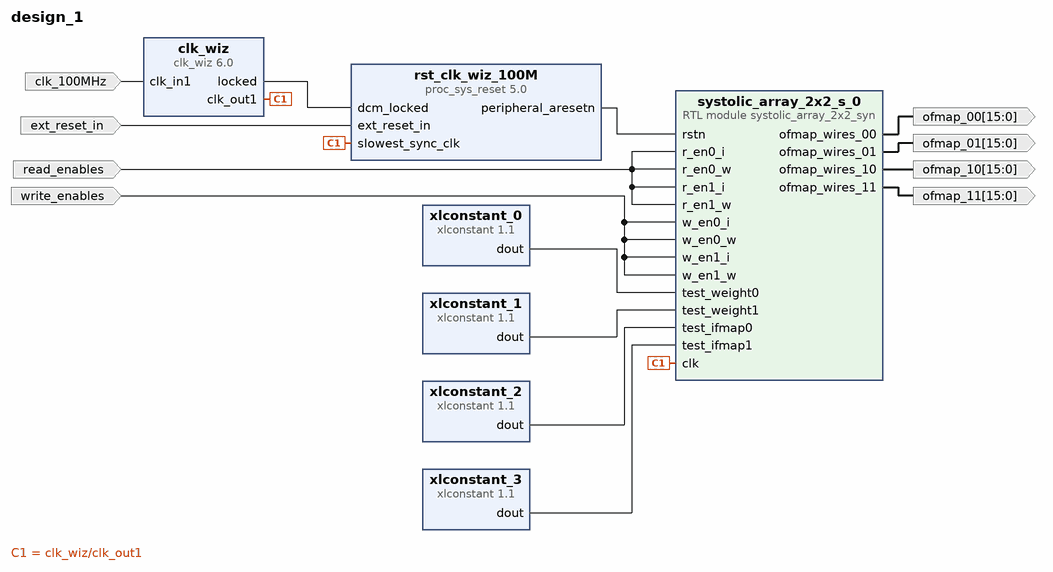
[diagram p0: block diagram of the top level]
# Vivado block design design_1, xczu7ev-ffvc1156-2-e, Vivado 2024.1
create_bd_design design_1

create_bd_port -dir I -type clk clk_100MHz
set_property -dict {CONFIG.FREQ_HZ 100000000} [get_bd_ports clk_100MHz]
create_bd_port -dir I read_enables
create_bd_port -dir I write_enables
create_bd_port -dir I ext_reset_in
create_bd_port -dir O -from 15 -to 0 ofmap_00
create_bd_port -dir O -from 15 -to 0 ofmap_01
create_bd_port -dir O -from 15 -to 0 ofmap_10
create_bd_port -dir O -from 15 -to 0 ofmap_11

create_bd_cell -type module -reference systolic_array_2x2_syn systolic_array_2x2_s_0
create_bd_cell -type ip -vlnv xilinx.com:ip:clk_wiz:6.0 clk_wiz
set_property -dict {CONFIG.CLKOUT1_REQUESTED_OUT_FREQ 100} [get_bd_cells clk_wiz]
create_bd_cell -type ip -vlnv xilinx.com:ip:proc_sys_reset:5.0 rst_clk_wiz_100M
create_bd_cell -type ip -vlnv xilinx.com:ip:xlconstant:1.1 xlconstant_0
set_property -dict {CONFIG.CONST_VAL 2 CONFIG.CONST_WIDTH 16} [get_bd_cells xlconstant_0]
create_bd_cell -type ip -vlnv xilinx.com:ip:xlconstant:1.1 xlconstant_1
set_property -dict {CONFIG.CONST_VAL 4 CONFIG.CONST_WIDTH 16} [get_bd_cells xlconstant_1]
create_bd_cell -type ip -vlnv xilinx.com:ip:xlconstant:1.1 xlconstant_2
set_property -dict {CONFIG.CONST_VAL -3 CONFIG.CONST_WIDTH 16} [get_bd_cells xlconstant_2]
create_bd_cell -type ip -vlnv xilinx.com:ip:xlconstant:1.1 xlconstant_3
set_property -dict {CONFIG.CONST_VAL -5 CONFIG.CONST_WIDTH 16} [get_bd_cells xlconstant_3]

# ---- connections ----

connect_bd_net [get_bd_ports clk_100MHz] [get_bd_pins clk_wiz/clk_in1]
connect_bd_net [get_bd_pins clk_wiz/clk_out1] [get_bd_pins systolic_array_2x2_s_0/clk] [get_bd_pins rst_clk_wiz_100M/slowest_sync_clk]
connect_bd_net [get_bd_pins clk_wiz/locked] [get_bd_pins rst_clk_wiz_100M/dcm_locked]
connect_bd_net [get_bd_ports ext_reset_in] [get_bd_pins rst_clk_wiz_100M/ext_reset_in]
connect_bd_net [get_bd_ports read_enables] \
  [get_bd_pins systolic_array_2x2_s_0/r_en0_w] [get_bd_pins systolic_array_2x2_s_0/r_en1_w] \
  [get_bd_pins systolic_array_2x2_s_0/r_en0_i] [get_bd_pins systolic_array_2x2_s_0/r_en1_i]
connect_bd_net [get_bd_pins rst_clk_wiz_100M/peripheral_aresetn] [get_bd_pins systolic_array_2x2_s_0/rstn]
connect_bd_net [get_bd_pins systolic_array_2x2_s_0/ofmap_wires_00] [get_bd_ports ofmap_00]
connect_bd_net [get_bd_pins systolic_array_2x2_s_0/ofmap_wires_01] [get_bd_ports ofmap_01]
connect_bd_net [get_bd_pins systolic_array_2x2_s_0/ofmap_wires_10] [get_bd_ports ofmap_10]
connect_bd_net [get_bd_pins systolic_array_2x2_s_0/ofmap_wires_11] [get_bd_ports ofmap_11]
connect_bd_net [get_bd_ports write_enables] \
  [get_bd_pins systolic_array_2x2_s_0/w_en0_w] [get_bd_pins systolic_array_2x2_s_0/w_en1_w] \
  [get_bd_pins systolic_array_2x2_s_0/w_en0_i] [get_bd_pins systolic_array_2x2_s_0/w_en1_i]
connect_bd_net [get_bd_pins xlconstant_0/dout] [get_bd_pins systolic_array_2x2_s_0/test_weight0]
connect_bd_net [get_bd_pins xlconstant_1/dout] [get_bd_pins systolic_array_2x2_s_0/test_weight1]
connect_bd_net [get_bd_pins xlconstant_2/dout] [get_bd_pins systolic_array_2x2_s_0/test_ifmap0]
connect_bd_net [get_bd_pins xlconstant_3/dout] [get_bd_pins systolic_array_2x2_s_0/test_ifmap1]

validate_bd_design
save_bd_design
